# EAGLE design ArduinoUNOinBoard (EAGLE 9.5.2)
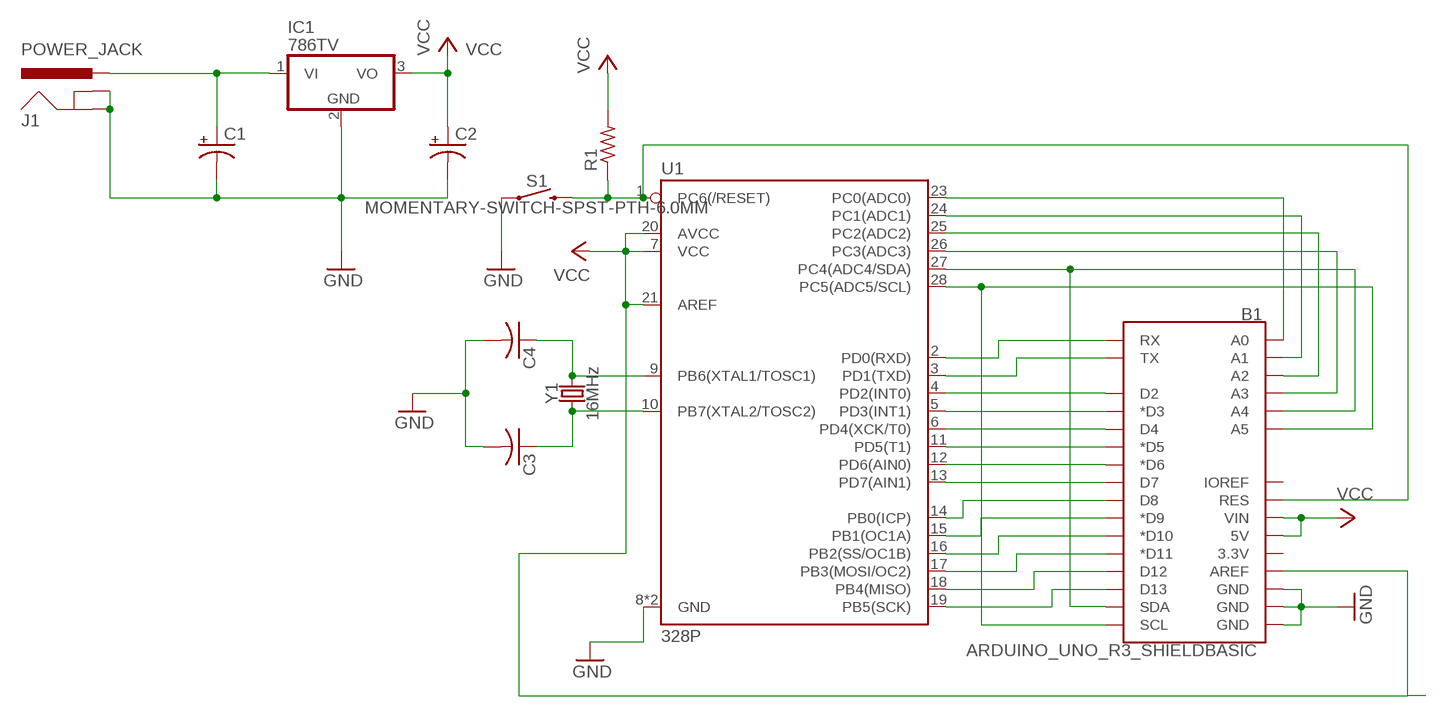
[diagram p0: schematic, sheet 1]

## Parts
B1  ARDUINO_UNO_R3_SHIELDBASIC  [UNO_R3_SHIELD]
C1  CPOL-USE2,5-6E  [E2,5-6E]
C2  CPOL-USE2,5-6E  [E2,5-6E]
C3  C-US025-024X044  [C025-024X044]
C4  C-US025-024X044  [C025-024X044]
IC1  786TV  [TO220V]
J1  POWER_JACK  [POWER_JACK_PTH]
R1  R-US_0204/7  [0204/7]
S1  MOMENTARY-SWITCH-SPST-PTH-6.0MM  [TACTILE_SWITCH_PTH_6.0MM]
U1  328P  ATMEGA328P_PDIP  [DIP28]
Y1  16MHz  CRYSTAL-16MHZPTH-HC49US  [HC49US]

## Nets
GND: B1.GND@0(GND) B1.GND@1(GND) B1.GND@2(GND) C1.- C2.- C3.2 C4.2 IC1.2(GND) J1.GND J1.GNDBREAK S1.1 U1.8(GND) U1.22(GND)
N$1: C1.+ IC1.1(VI) J1.PWR
N$2: C4.1 U1.9(PB6(XTAL1/TOSC1)) Y1.2
N$3: C3.1 U1.10(PB7(XTAL2/TOSC2)) Y1.1
N$4: B1.RES R1.1 S1.3 U1.1(PC6(/RESET))
N$5: B1.RX U1.2(PD0(RXD))
N$6: B1.TX U1.3(PD1(TXD))
N$7: B1.D2 U1.4(PD2(INT0))
N$8: B1.D3(*D3) U1.5(PD3(INT1))
N$9: B1.D4 U1.6(PD4(XCK/T0))
N$10: B1.D5(*D5) U1.11(PD5(T1))
N$11: B1.D6(*D6) U1.12(PD6(AIN0))
N$12: B1.D7 U1.13(PD7(AIN1))
N$13: B1.D8 U1.14(PB0(ICP))
N$14: B1.D9(*D9) U1.15(PB1(OC1A))
N$15: B1.D10(*D10) U1.16(PB2(SS/OC1B))
N$16: B1.D11(*D11) U1.17(PB3(MOSI/OC2))
N$17: B1.D12 U1.18(PB4(MISO))
N$18: B1.D13 U1.19(PB5(SCK))
N$19: B1.A0 U1.23(PC0(ADC0))
N$20: B1.A1 U1.24(PC1(ADC1))
N$21: B1.A2 U1.25(PC2(ADC2))
N$22: B1.A3 U1.26(PC3(ADC3))
N$23: B1.A4 B1.SDA U1.27(PC4(ADC4/SDA))
N$24: B1.A5 B1.SCL U1.28(PC5(ADC5/SCL))
VCC: B1.5V B1.AREF B1.VIN C2.+ IC1.3(VO) R1.2 U1.7(VCC) U1.20(AVCC) U1.21(AREF)
Unconnected: B1.3.3V B1.IOREF

## Library data of the parts
B1 = SparkFun-Boards:ARDUINO_UNO_R3_SHIELD: Arduino R3 Shield Footprint Shield form compatible with the Arduino Uno R3. SparkFun Products: MG2639 Cellular Shield <https://www.sparkfun.com/products/13120> MIDI Shield <https://www.sparkfun.com/products/12898> R3 Stackable Headers Kit <https://www.sparkfun.com/products/11417>
C1 C2 = rcl:CPOL-US: POLARIZED CAPACITOR, American symbol; SPICEPREFIX: C
C3 C4 = rcl:C-US: CAPACITOR, American symbol; SPICEPREFIX: C
IC1 = linear:78*: Positive VOLTAGE REGULATOR Source: http://cache.national.com/ds/LM/LM78L05.pdf http://www.fairchildsemi.com/ds/LM/LM7805.pdf
J1 = SparkFun-Connectors:POWER_JACK: Power Jack Connector This is the standard 5.5mm barrel jack for power. The PTH is the most common, proven, reliable, footprint. The Slot footprint only works if the mill layer is transmitted to the PCB fab house so be warned. Here are the connectors we sell at SparkFun: DC Barrel Power Jack/Connector <https://www.sparkfun.com/products/119> (PRT-00119) DC Barrel Power Jack/Connector (SMD) <https://www.sparkfun.com/products/12748> (PRT-12748) DC Barrel Jack Adapter - Breadboard Compatible <https://www.sparkfun.com/products/10811> (PRT-10811) It is used on this SparkFun product (and many, many others): SparkFun RedBoard - Programmed with Arduino <https://www.sparkfun.com/products/12757> (DEV-12757) Also, if you need a mating power supply or connector, please check these out: Wall Adapter Power Supply - 9VDC 650mA <https://www.sparkfun.com/products/298> (TOL-00298) DC Barrel Jack Adapter - Male <https://www.sparkfun.com/products/10287> (PRT-10287); PROD_ID: CONN-08197
R1 = rcl:R-US_: RESISTOR, American symbol; SPICEPREFIX: R
S1 = SparkFun-Switches:MOMENTARY-SWITCH-SPST: Momentary Switch (Pushbutton) - SPST Normally-open (NO) SPST momentary switches (buttons, pushbuttons). Variants PTH-12MM - 12mm square, through-hole Momentary Pushbutton Switch - 12mm Square <https://www.sparkfun.com/products/9190> (COM-09190) PTH-6.0MM, PTH-6.0MM-KIT - 6.0mm square, through-hole Mini Pushbutton Switch <https://www.sparkfun.com/products/97> (COM-00097) KIT package intended for soldering kit's - only one side of pads' copper is exposed. PTH-RIGHT-ANGLE-KIT - Right-angle, through-hole Right Angle Tactile Button <https://www.sparkfun.com/products/10791> - Used on SparkFun BigTime Watch Kit <https://www.sparkfun.com/products/11734> SMD-12MM - 12mm square, surface-mount Tactile Button - SMD (12mm) <https://www.sparkfun.com/products/12993> (COM-12993) Used on SparkFun PicoBoard <https://www.sparkfun.com/products/11888> SMD-4.5MM - 4.5mm Square Trackball Switch Used on SparkFun Blackberry Trackballer Breakout <https://www.sparkfun.com/products/13169> SMD-4.6MMX2.8MM - 4.60mm x 2.80mm, surface mount Used on SparkFun SAMD21 Mini Breakout <https://www.sparkfun.com/products/13664> SMD-5.2MM, SMD-5.2-REDUNDANT - 5.2mm square, surface-mount Mini Pushbutton Switch - SMD <https://www.sparkfun.com/products/8720> (COM-08720) Used on Arduino Pro Mini <https://www.sparkfun.com/products/11114> REDUNDANT package connects both switch circuits together SMD-6.0X3.5MM - 6.0 x 3.5mm, surface mount Momentary Reset Switch SMD <https://www.sparkfun.com/products/8229> (COM-08229) SMD-6.2MM-TALL - 6.2mm square, surface mount Tactile Button - SMD (6mm) <https://www.sparkfun.com/products/12992> Used on SparkFun Digital Sandbox <https://www.sparkfun.com/products/12651> SMD-RIGHT-ANGLE - Right-angle, surface mount Used on SparkFun Block for Intel® Edison - Arduino <https://www.sparkfun.com/products/13036>; PROD_ID: SWCH-08441; SF_SKU: COM-00097
U1 = SparkFun-IC-Microcontroller:ATMEGA328P_PDIP: Atmel 328P Through hole ATMEGA328P uC used in the Arduino 32kb flash, 1k EEPROM, 2k SRAM Datasheet <http://www.sparkfun.com/datasheets/Components/SMD/ATMega328.pdf> SparkFun Products Storefront component: AVR 28 Pin 20MHz 32K 6A/D - ATMega328P <https://www.sparkfun.com/products/9061> (COM-09061) SparkFun Simon Says - Through-Hole Soldering Kit <https://www.sparkfun.com/products/10547> (KIT-10547) SparkFun Learn to Solder - Simon Says <https://www.sparkfun.com/products/13708> (KIT-13708) SparkFun BigTime Watch Kit <https://www.sparkfun.com/products/11734> (KIT-11734) SparkFun ClockIt <https://www.sparkfun.com/products/10930> (KIT-10930) SparkFun Serial Enabled LCD Kit <https://www.sparkfun.com/products/10097> (LCD-10097) SparkFun Simon Tilts - Through Hole Soldering Kit <https://www.sparkfun.com/products/12634> (KIT-12634) SparkFun Frequency Counter Kit <https://www.sparkfun.com/products/10140> (KIT-10140) FabFM Radio Kit <https://www.sparkfun.com/products/11043> (KIT-11043) SparkFun Binary Blaster Kit <https://www.sparkfun.com/products/12037> (KIT-12037) SparkFun Metro-Gnome <https://www.sparkfun.com/products/9236> (KIT-09236) ATmega328 with Arduino Optiboot (Uno) <https://www.sparkfun.com/products/10524> (DEV-10524); PROD_ID: IC-09136
Y1 = SparkFun-Clocks:CRYSTAL-16MHZ: 16MHz Crystal Digikey Example <http://www.digikey.com/product-search/en?keywords=535-9122-1-ND> Frequency: 16MHz Frequency Stability: ±50ppm Frequency Tolerance: ±20ppm Load Capacitance: 18pF SparkFun Products: Pro Micro -5V/16MHz <https://www.sparkfun.com/products/12640> SparkFun Serial Enabled LCD Kit <https://www.sparkfun.com/products/10097>; PROD_ID: XTAL-08181; SF_ID: COM-00536

## Board
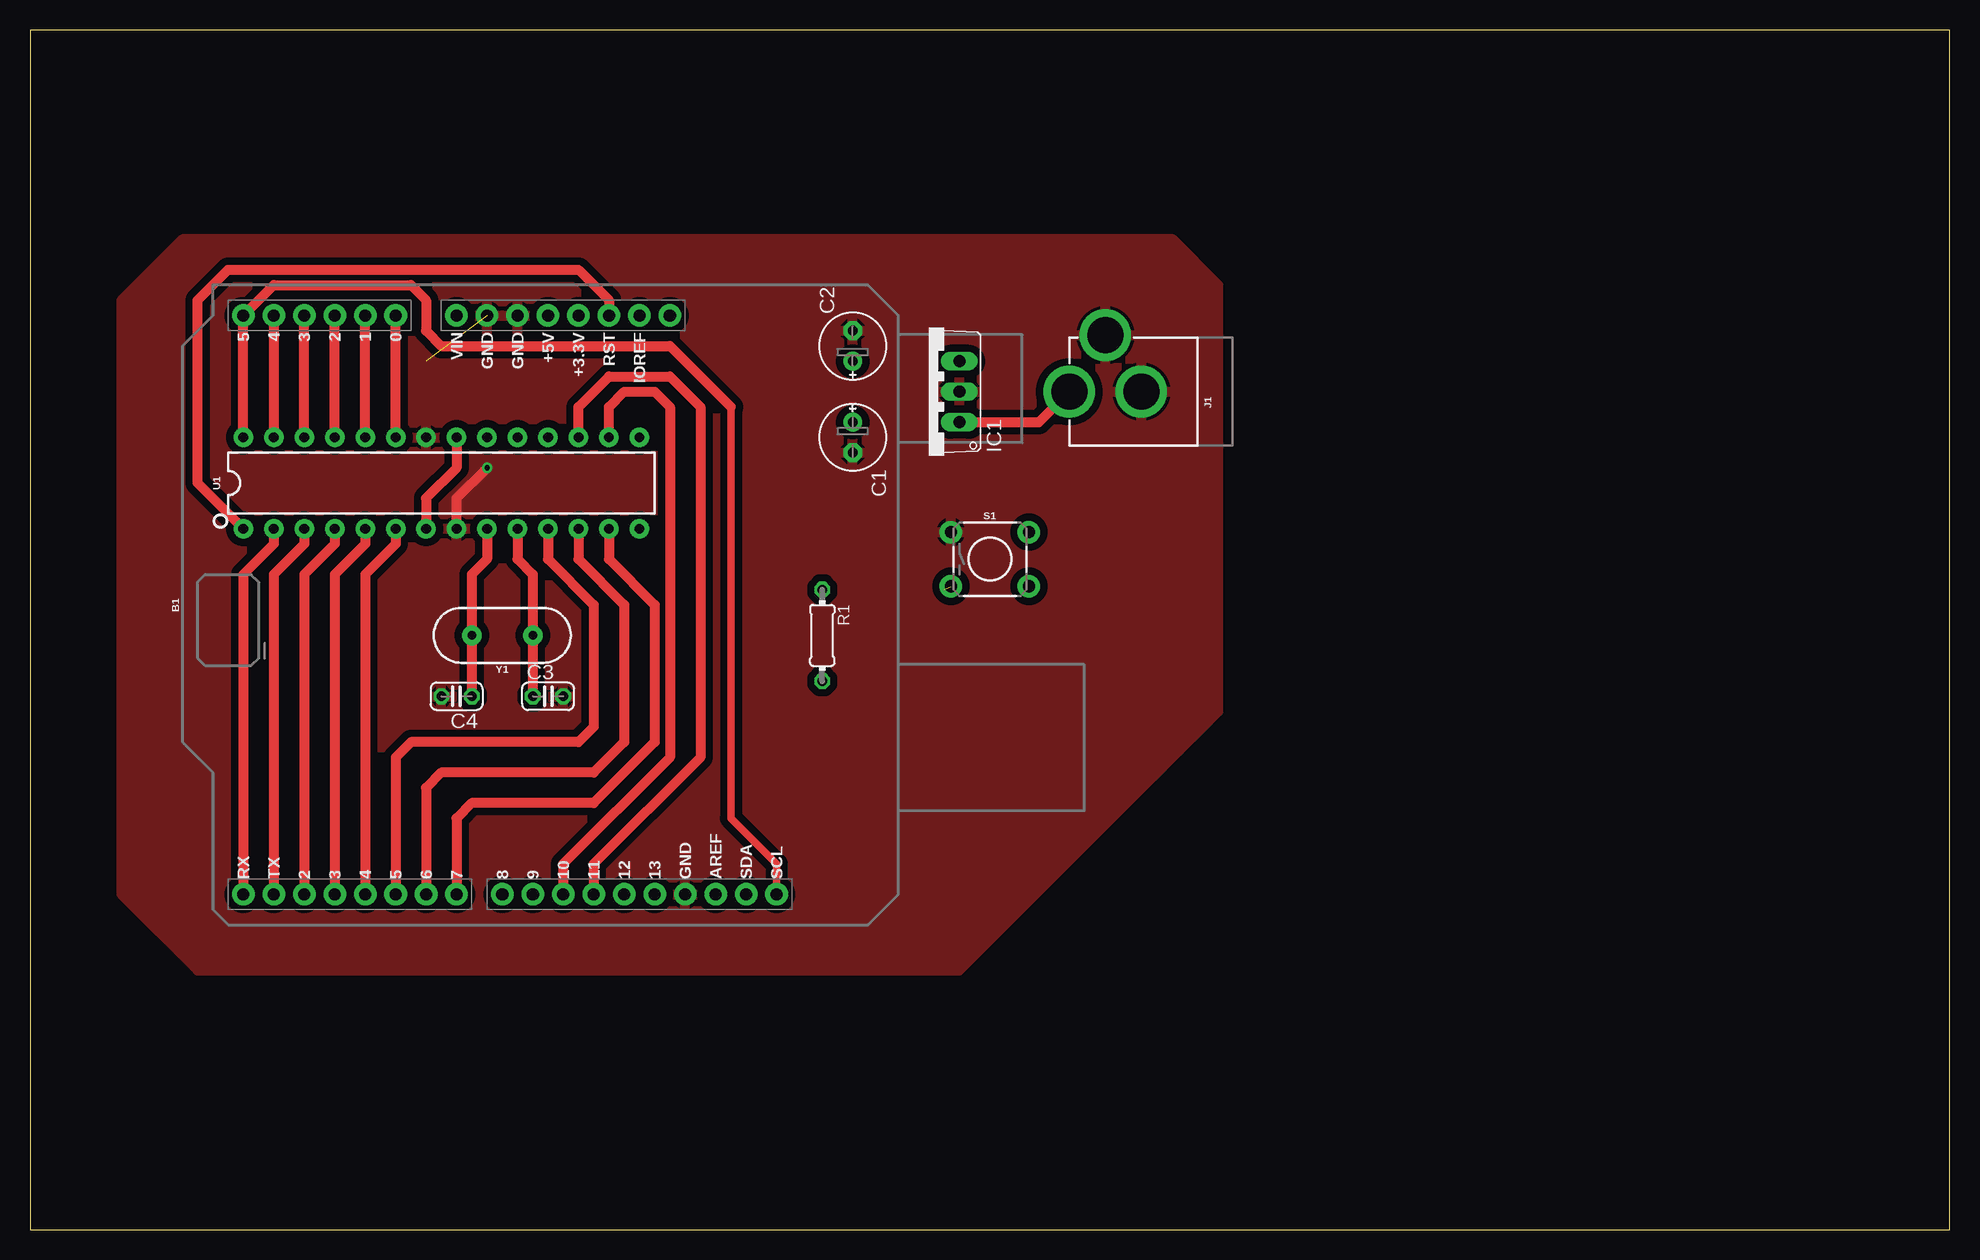
[diagram p1: board, top side]
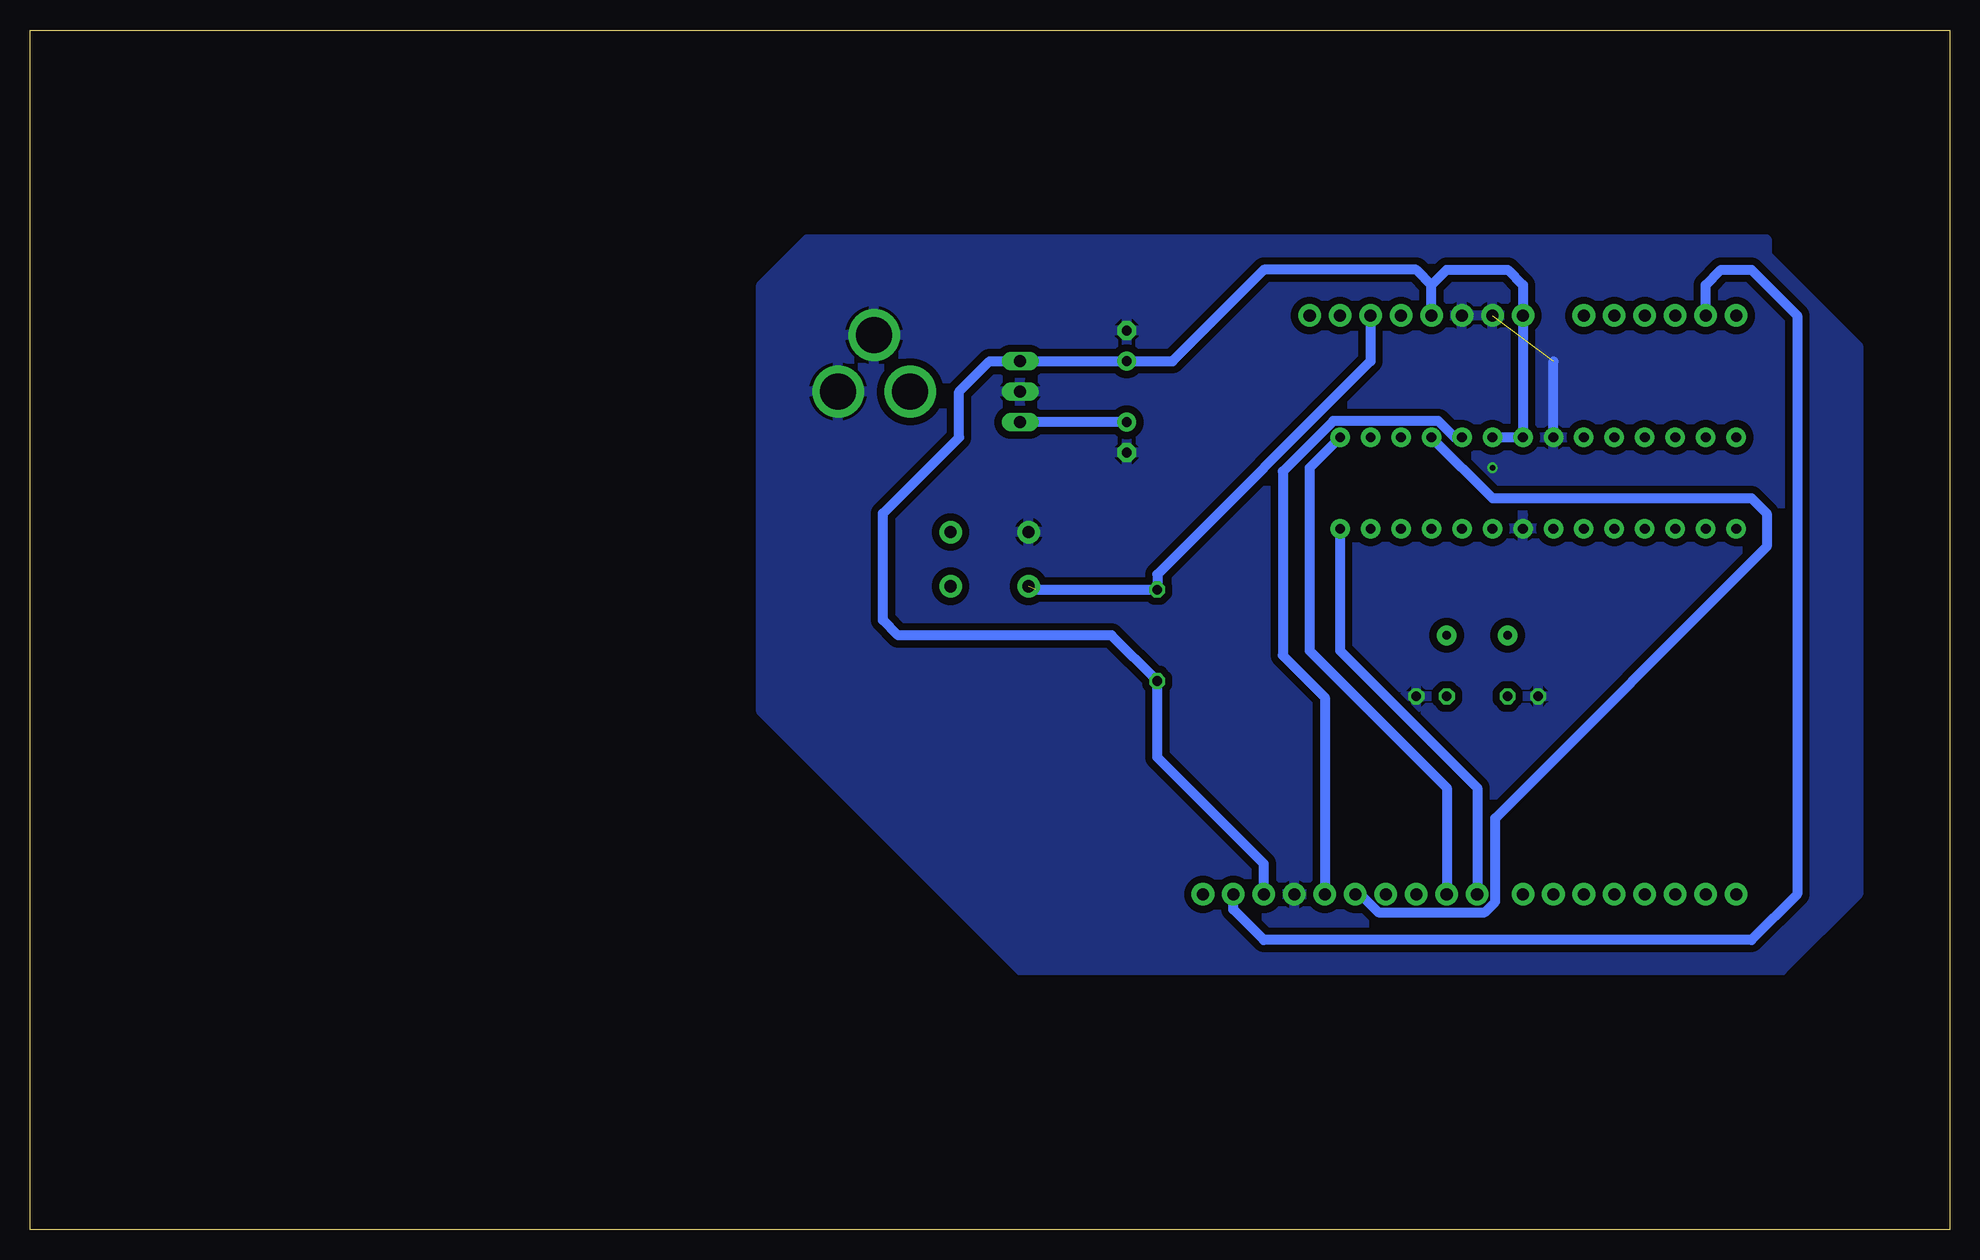
[diagram p2: board, bottom side, seen from below]

Size 160 x 100 mm. Coordinates in mm from the lower left corner, seen from the top.
Outline: 0,0 160,0 160,100 0,100 0,0
Copper layers (1*16): Top 0.035mm / dielectric 1.5mm / Bottom 0.035mm
Design rules "default": minimum track width 6mil, minimum drill 0.35mm, track to track 6mil, track to pad 6mil, pad to pad 6mil, via to via 6mil, smd to smd 6mil, copper to edge 40mil, drill to drill 6mil, minimum pad ring 10mil, minimum via ring 8mil, stop-mask expansion 4mil, vias tented up to drill 0mil, thermal gap 10mil

### Footprints (pad centres in the part's own frame; a part is rotated, then mirrored left to right if it is on the bottom)
UNO_R3_SHIELD = drill 1.016 pad 1.88: 3.3V 24.13,-2.54; 5V 24.13,0; A0 24.13,12.7; A1 24.13,15.24; A2 24.13,17.78; A3 24.13,20.32; A4 24.13,22.86; A5 24.13,25.4; AREF -24.13,-13.97; D2 -24.13,20.32; D3 -24.13,17.78; D4 -24.13,15.24; D5 -24.13,12.7; D6 -24.13,10.16; D7 -24.13,7.62; D8 -24.13,3.81; D9 -24.13,1.27; D10 -24.13,-1.27; D11 -24.13,-3.81; D12 -24.13,-6.35; D13 -24.13,-8.89; GND@0 24.13,2.54; GND@1 24.13,5.08; GND@2 -24.13,-11.43; IOREF 24.13,-7.62; NC 24.13,-10.16; RES 24.13,-5.08; RX -24.13,25.4; SCL -24.13,-19.05; SDA -24.13,-16.51; TX -24.13,22.86; VIN 24.13,7.62
E2,5-6E = drill 0.813 pad 1.575: + -1.27,0 | drill 0.813 pad 1.575 octagon: - 1.27,0
C025-024X044 = drill 0.813 octagon: 1 -1.27,0; 2 1.27,0
TO220V = drill 1.016 long: 1 -2.54,-2.54; 2 0,-2.54; 3 2.54,-2.54
POWER_JACK_PTH = drill 2.997 pad 4.318: GND 0,7.7; GNDBREAK 4.7,10.7; PWR 0,13.7
0204/7 = drill 0.813 octagon: 1 -3.81,0; 2 3.81,0
TACTILE_SWITCH_PTH_6.0MM = drill 1.016 pad 1.88: 1 -3.251,2.261; 2 3.251,2.261; 3 -3.251,-2.261; 4 3.251,-2.261
DIP28 = drill 0.813 pad 1.626: 1 -16.51,-3.81; 2 -13.97,-3.81; 3 -11.43,-3.81; 4 -8.89,-3.81; 5 -6.35,-3.81; 6 -3.81,-3.81; 7 -1.27,-3.81; 8 1.27,-3.81; 9 3.81,-3.81; 10 6.35,-3.81; 11 8.89,-3.81; 12 11.43,-3.81; 13 13.97,-3.81; 14 16.51,-3.81; 15 16.51,3.81; 16 13.97,3.81; 17 11.43,3.81; 18 8.89,3.81; 19 6.35,3.81; 20 3.81,3.81; 21 1.27,3.81; 22 -1.27,3.81; 23 -3.81,3.81; 24 -6.35,3.81; 25 -8.89,3.81; 26 -11.43,3.81; 27 -13.97,3.81; 28 -16.51,3.81
HC49US = drill 0.7 pad 1.651: 1 -2.54,0; 2 2.54,0

### Placement (x,y rotation side)
B1  43.18,52.07 90 top
C1  68.58,66.04 270 top
C2  68.58,73.66 90 top
C3  43.18,44.45 0 top
C4  35.56,44.45 180 top
IC1  74.93,69.85 90 top
J1  100.33,69.85 90 top
R1  66.04,49.53 270 top
S1  80.01,55.88 0 top
U1  34.29,62.23 0 top
Y1  39.37,49.53 180 top

### Tracks (layer width: path | path; a pad name or v marks a point on that pad's centre or on a via)
GND  (via drill 0.45)  (1 unrouted)
  Top 0.813: U1.8 35.56,60.96 v38.1,63.5
  Bottom 0.813: U1.22 33.02,72.39
  pour Bottom (isolate 0.61): 15.24,82.55 15.24,81.28 7.62,73.66 7.62,27.94 13.97,21.59 77.47,21.59 99.06,43.18 99.06,78.74 96.52,81.28 95.25,82.55
  pour Top (isolate 0.61): 12.7,82.55 7.62,77.47 7.62,27.94 13.97,21.59 77.47,21.59 99.06,43.18 99.06,78.74 95.25,82.55
N$1
  Top 0.813: IC1.1 84.09,67.31 J1.PWR
  Bottom 0.813: C1.+ IC1.1
N$2
  Top 0.813: U1.9 38.1,55.88 36.83,54.61 Y1.2 C4.1
N$3
  Top 0.813: U1.10 40.64,55.88 41.91,54.61 Y1.1 C3.1
N$4  (1 unrouted)
  Top 0.813: U1.1 13.97,62.23 13.97,77.47 16.51,80.01 45.72,80.01 48.26,77.47 B1.RES
  Bottom 0.813: 76.2,53.34 R1.1 66.04,54.61 48.26,72.39 B1.RES
N$5
  Top 0.813: U1.2 20.32,57.15 17.78,54.61 B1.RX
N$6
  Top 0.813: U1.3 22.86,57.15 20.32,54.61 B1.TX
N$7
  Top 0.813: U1.4 25.4,57.15 22.86,54.61 B1.D2
N$8
  Top 0.813: U1.5 27.94,57.15 25.4,54.61 B1.D3
N$9
  Top 0.813: U1.6 30.48,57.15 27.94,54.61 B1.D4
N$10
  Top 0.813: B1.D5 30.48,39.37 31.75,40.64 45.72,40.64 46.99,41.91 46.99,52.07 43.18,55.88 U1.11
N$11
  Top 0.813: U1.12 45.72,55.88 49.53,52.07 49.53,40.64 46.99,38.1 34.29,38.1 33.02,36.83 B1.D6
N$12
  Top 0.813: U1.13 48.26,55.88 52.07,52.07 52.07,40.64 46.99,35.56 36.83,35.56 35.56,34.29 B1.D7
N$13
  Bottom 0.813: U1.14 50.8,48.26 39.37,36.83 B1.D8
N$14
  Bottom 0.813: U1.15 53.34,63.5 53.34,48.26 41.91,36.83 B1.D9
N$15
  Top 0.813: U1.16 48.26,68.58 49.53,69.85 52.07,69.85 53.34,68.58 53.34,39.37 44.45,30.48 B1.D10
N$16
  Top 0.813: U1.17 45.72,68.58 48.26,71.12 53.34,71.12 55.88,68.58 55.88,39.37 46.99,30.48 B1.D11
N$17
  Bottom 0.813: B1.D12 49.11,27.94 47.61,26.44 38.75,26.44 37.87,27.32 37.87,34.29 15.24,56.92 15.24,59.69 16.51,60.96 38.1,60.96 U1.18
N$18
  Bottom 0.813: B1.D13 52.07,44.35 55.58,47.86 55.58,63.2 51.37,67.41 42.61,67.41 41.24,66.04 U1.19
N$19
  Top 0.813: U1.23 B1.A0
N$20
  Top 0.813: U1.24 B1.A1
N$21
  Top 0.813: U1.25 B1.A2
N$22
  Top 0.813: U1.26 B1.A3
N$23
  Top 0.813: B1.A4 U1.27
  Bottom 0.813: B1.A4 20.32,78.74 19.05,80.01 16.51,80.01 12.7,76.2 12.7,27.94 16.51,24.13 57.15,24.13 59.69,26.67 B1.SDA
N$24
  Top 0.61: B1.SCL 62.23,30.48 58.42,34.29 58.42,68.58
  Top 0.813: U1.28 B1.A5 20.32,78.74 31.75,78.74 33.02,77.47 33.02,74.93 34.29,73.66 53.34,73.66 58.42,68.58
VCC
  Top 0.813: U1.21 35.56,63.5 33.02,60.96 U1.7
  Bottom 0.813: B1.AREF 57.15,30.48 66.04,39.37 R1.2 69.85,49.53 87.63,49.53 88.9,50.8 88.9,59.69 82.55,66.04 82.55,69.85 80.01,72.39 IC1.3 C2.+ 64.77,72.39 57.15,80.01 44.45,80.01 43.18,78.74 | B1.5V 43.18,78.74 | 43.18,78.74 41.91,80.01 36.83,80.01 35.56,78.74 B1.VIN U1.21 U1.20